# EAGLE schematic zapojeni (EAGLE 7.2.0)
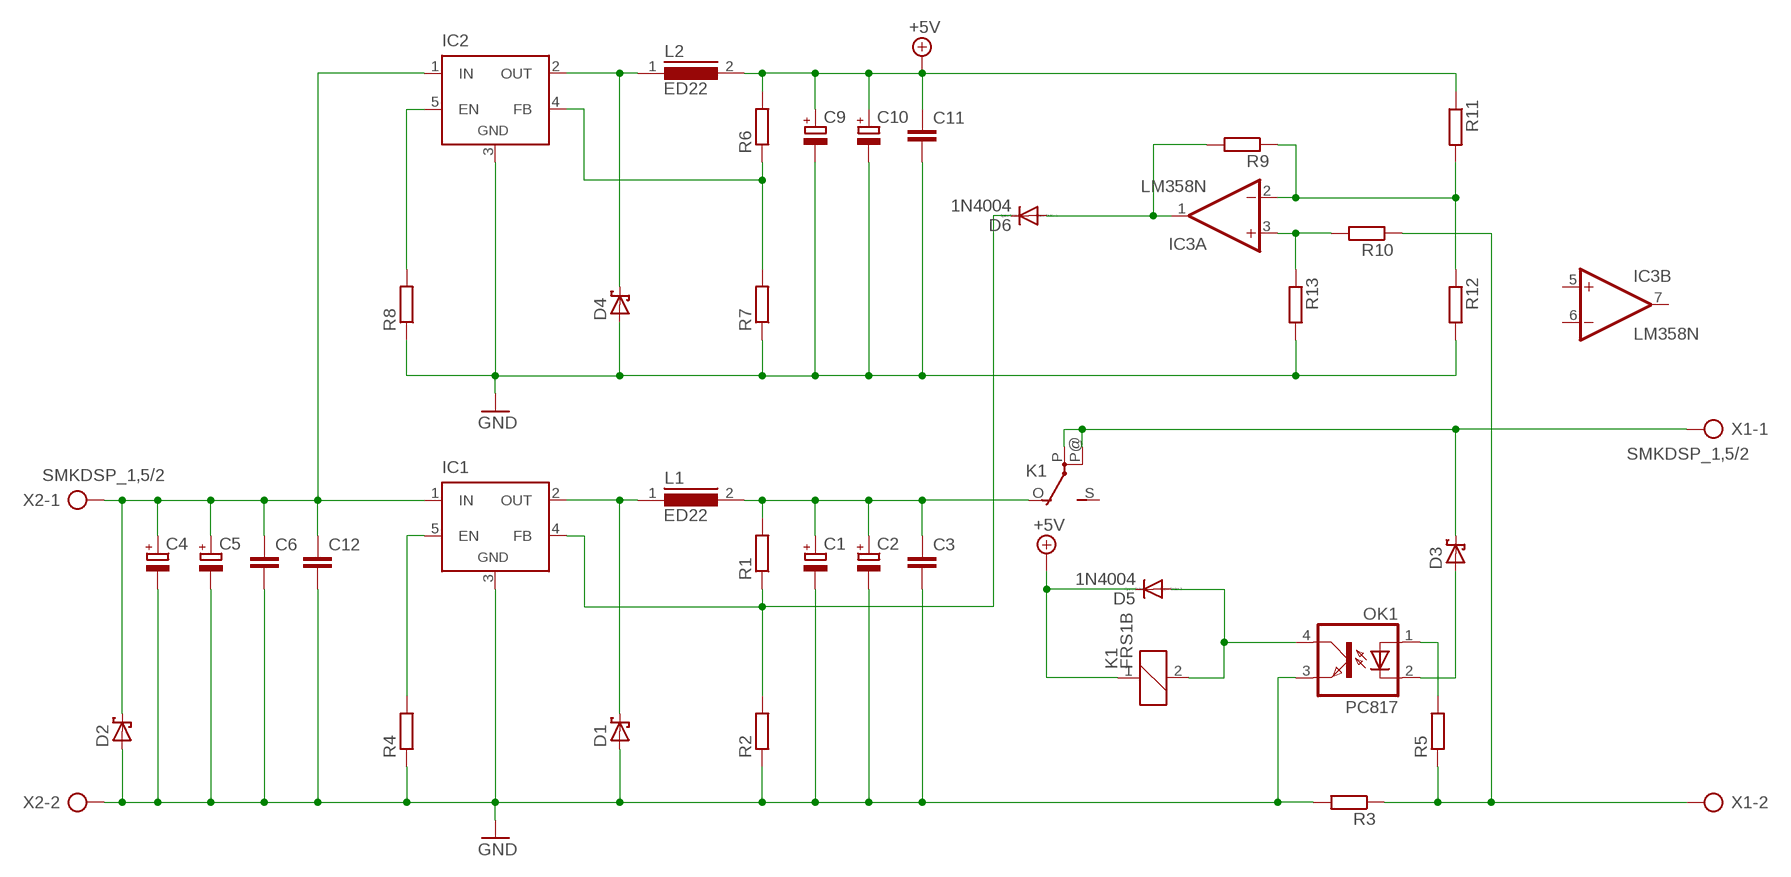
[diagram p0: schematic, sheet 1]

## Parts
C1  CPOL-EUE5-8.5  [E5-8,5]
C2  CPOL-EUE5-8.5  [E5-8,5]
C3  C-EU050-035X075  [C050-035X075]
C4  CPOL-EUE5-8.5  [E5-8,5]
C5  CPOL-EUE5-8.5  [E5-8,5]
C6  C-EU050-035X075  [C050-035X075]
C9  CPOL-EUE5-8.5  [E5-8,5]
C10  CPOL-EUE5-8.5  [E5-8,5]
C11  C-EU050-035X075  [C050-035X075]
C12  C-EU050-035X075  [C050-035X075]
D1  SCHOTTKY-DIODEDO201T15  [DO201T15]
D2  SCHOTTKY-DIODEDO201T15  [DO201T15]
D3  SCHOTTKY-DIODEDO201T15  [DO201T15]
D4  SCHOTTKY-DIODEDO201T15  [DO201T15]
D5  1N4004  [DO41-10]
D6  1N4004  [DO41-10]
IC1  LM2596TH  [TO220-52]
IC2  LM2596TH  [TO220-52]
IC3  LM358N  [DIL08]
K1  FRS1B  [FRS1B]
L1  ED22  [ED22]
L2  ED22  [ED22]
OK1  PC817  [DIL04]
R1  R-EU_0207/10  [0207/10]
R2  R-EU_0207/10  [0207/10]
R3  R-EU_0207/10  [0207/10]
R4  R-EU_0207/10  [0207/10]
R5  R-EU_0207/10  [0207/10]
R6  R-EU_0207/10  [0207/10]
R7  R-EU_0207/10  [0207/10]
R8  R-EU_0207/10  [0207/10]
R9  R-EU_0207/10  [0207/10]
R10  R-EU_0207/10  [0207/10]
R11  R-EU_0207/10  [0207/10]
R12  R-EU_0207/10  [0207/10]
R13  R-EU_0207/10  [0207/10]
X1  SMKDSP_1,5/2  [SMKDSP_1,5/2]
X2  SMKDSP_1,5/2  [SMKDSP_1,5/2]

## Nets
+5V: C9.+ C10.+ C11.1 D5.C K1.1 L2.2 R6.2 R11.1
GND: C1.- C2.- C3.2 C4.- C5.- C6.2 C9.- C10.- C11.2 C12.2 D1.A D2.A D4.A IC1.3(GND) IC2.3(GND) OK1.3(EMIT) R2.1 R3.2 R4.1 R7.1 R8.1 R12.2 R13.2 X2.2
N$1: C1.+ C2.+ C3.1 K1.O(2:O) L1.2 R1.2
N$2: D6.C IC1.4(FB) R1.1 R2.2
N$3: D1.C IC1.2(OUT) L1.1
N$4: D4.C IC2.2(OUT) L2.1
N$5: C4.+ C5.+ C6.1 C12.1 D2.C IC1.1(IN) IC2.1(IN) X2.1
N$6: R3.1 R5.1 R10.1 X1.2
N$7: D3.A OK1.2(C)
N$8: IC1.5(EN) R4.2
N$9: OK1.1(A) R5.2
N$10: D5.A K1.2 OK1.4(COL)
N$11: IC2.4(FB) R6.1 R7.2
N$12: D3.C K1.P(2:P) K1.P@(2:P) X1.1
N$13: D6.A IC3.1(A:OUT) R9.2
N$14: IC2.5(EN) R8.2
N$15: IC3.3(A:+IN) R10.2 R13.1
N$16: IC3.2(A:-IN) R9.1 R11.2 R12.1
Unconnected: IC3.5(B:+IN) IC3.6(B:-IN) IC3.7(B:OUT) K1.S(2:S)

## Power pins joined to a net without a drawn wire
V+: IC3.8(P:V+)
V-: IC3.4(P:V-)

## Library data of the parts
C1 C2 C4 C5 C9 C10 = resistor:CPOL-EU: POLARIZED CAPACITOR, European symbol
C3 C6 C11 C12 = resistor:C-EU: CAPACITOR, European symbol
D1-D4 = diode:SCHOTTKY-DIODE: Schottky Diode
D5 D6 = diode:1N4004: DIODE general purpose rectifier, 1 A
IC1 IC2 = linear:LM2596T: STEP-DOWN VOLTAGE REGULATOR
IC3 = linear:LM358: OP AMP also LM158; LM258; LM2904 Source: http://cache.national.com/ds/LM/LM158.pdf
K1 = relay:FRS1B: RELAY 1 x switch, same as V23101-D6-A201, Siemens; OC_FARNELL: unknown; OC_NEWARK: unknown
L1 L2 = inductors:ED22: INDUCTOR
OK1 = optocoupler:PC817: SHARP OPTO COUPLER; MPN: PC817X4J000F; OC_FARNELL: 9707727; OC_NEWARK: 97K7059
R1-R13 = resistor:R-EU_: RESISTOR, European symbol
X1 X2 = con-phoenix-smkdsp:SMKDSP_1,5/2: Printklemme, Nennstrom: 17,5 A, Bemessungsspannung: 250 V, Raster: 5,0 mm Source: http://eshop.phoenixcontact.de .. 1733415.pdf; MF: FARNELL; MPN: 1733570; OC_FARNELL: 3041244; OC_NEWARK: 69C8588